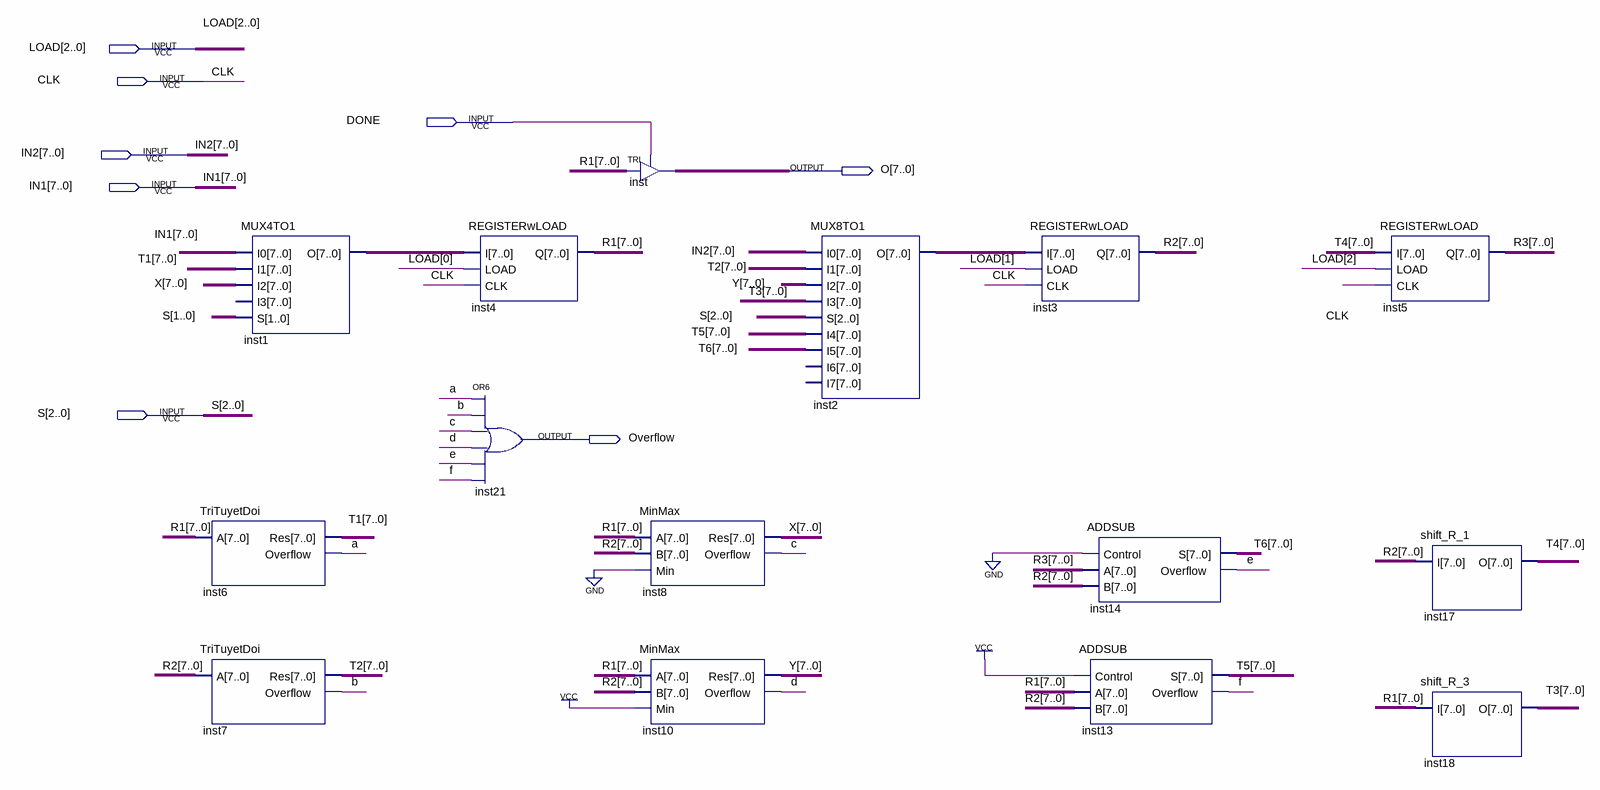
[diagram p0: schematic sheet]
// Quartus schematic DATAPATH_1.bdf as structural Verilog: 15 symbols, 8 pins
module DATAPATH_1 (
  input  [2:0] LOAD,
  input  CLK,
  input  DONE,
  input  [7:0] IN2,
  input  [7:0] IN1,
  input  [2:0] S,
  output [7:0] O,
  output Overflow
);

  wire a, b, c, d, e, f;
  wire [7:0] inst1_o, inst2_o, R1, R2, R3, T1, T2, T3, T4, T5, T6, X, Y;

  MUX4TO1 inst1 (.I0(IN1), .I1(T1), .I2(X), .S(S[1:0]), .O(inst1_o));  // open: I3
  TriTuyetDoi inst6 (.A(R1), .Res(T1), .Overflow(a));
  TriTuyetDoi inst7 (.A(R2), .Res(T2), .Overflow(b));
  REGISTERwLOAD inst4 (.I(inst1_o), .LOAD(LOAD[0]), .CLK(CLK), .Q(R1));
  or inst21 (Overflow, a, b, c, d, e, f);
  TRI inst[7:0] (.IN(R1), .OE(DONE), .OUT(O));
  MinMax inst8 (.A(R1), .B(R2), .Min(1'b0), .Res(X), .Overflow(c));
  MinMax inst10 (.A(R1), .B(R2), .Min(1'b1), .Res(Y), .Overflow(d));
  MUX8TO1 inst2 (.I0(IN2), .I1(T2), .I2(Y), .I3(T3), .S(S), .I4(T5), .I5(T6), .O(inst2_o));  // open: I6, I7
  REGISTERwLOAD inst3 (.I(inst2_o), .LOAD(LOAD[1]), .CLK(CLK), .Q(R2));
  ADDSUB inst14 (.Control(1'b0), .A(R3), .B(R2), .S(T6), .Overflow(e));
  ADDSUB inst13 (.Control(1'b1), .A(R1), .B(R2), .S(T5), .Overflow(f));
  REGISTERwLOAD inst5 (.I(T4), .LOAD(LOAD[2]), .CLK(CLK), .Q(R3));
  shift_R_1 inst17 (.I(R2), .O(T4));
  shift_R_3 inst18 (.I(R1), .O(T3));
endmodule
